# Altium schematic sheet [06] - CPU - ETHERNET, SATA.SchDoc
size A2; DocumentNumber: 6; SheetNumber: 6; SheetTotal: 32
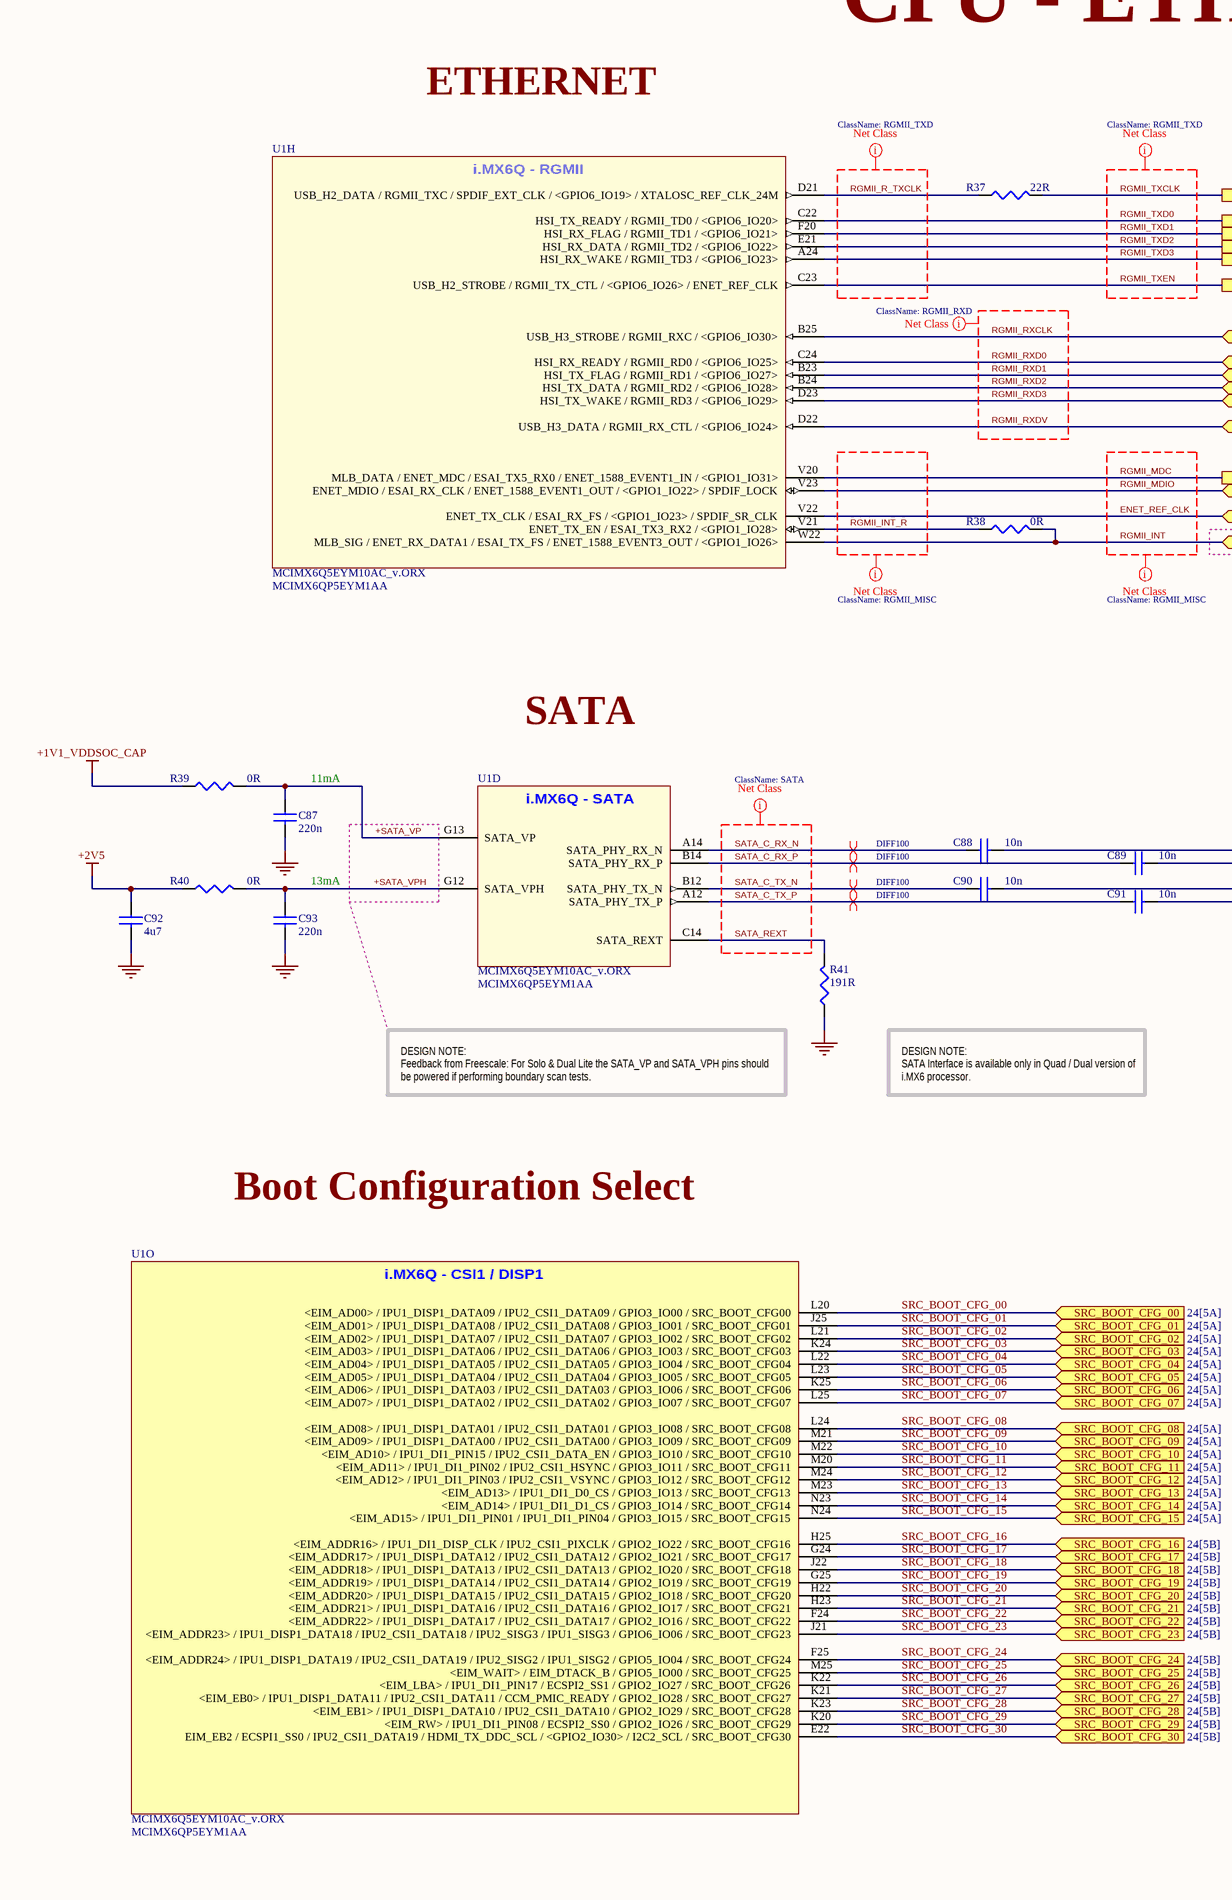
[diagram p0: [06] - CPU - ETHERNET, SATA.SchDoc, left]
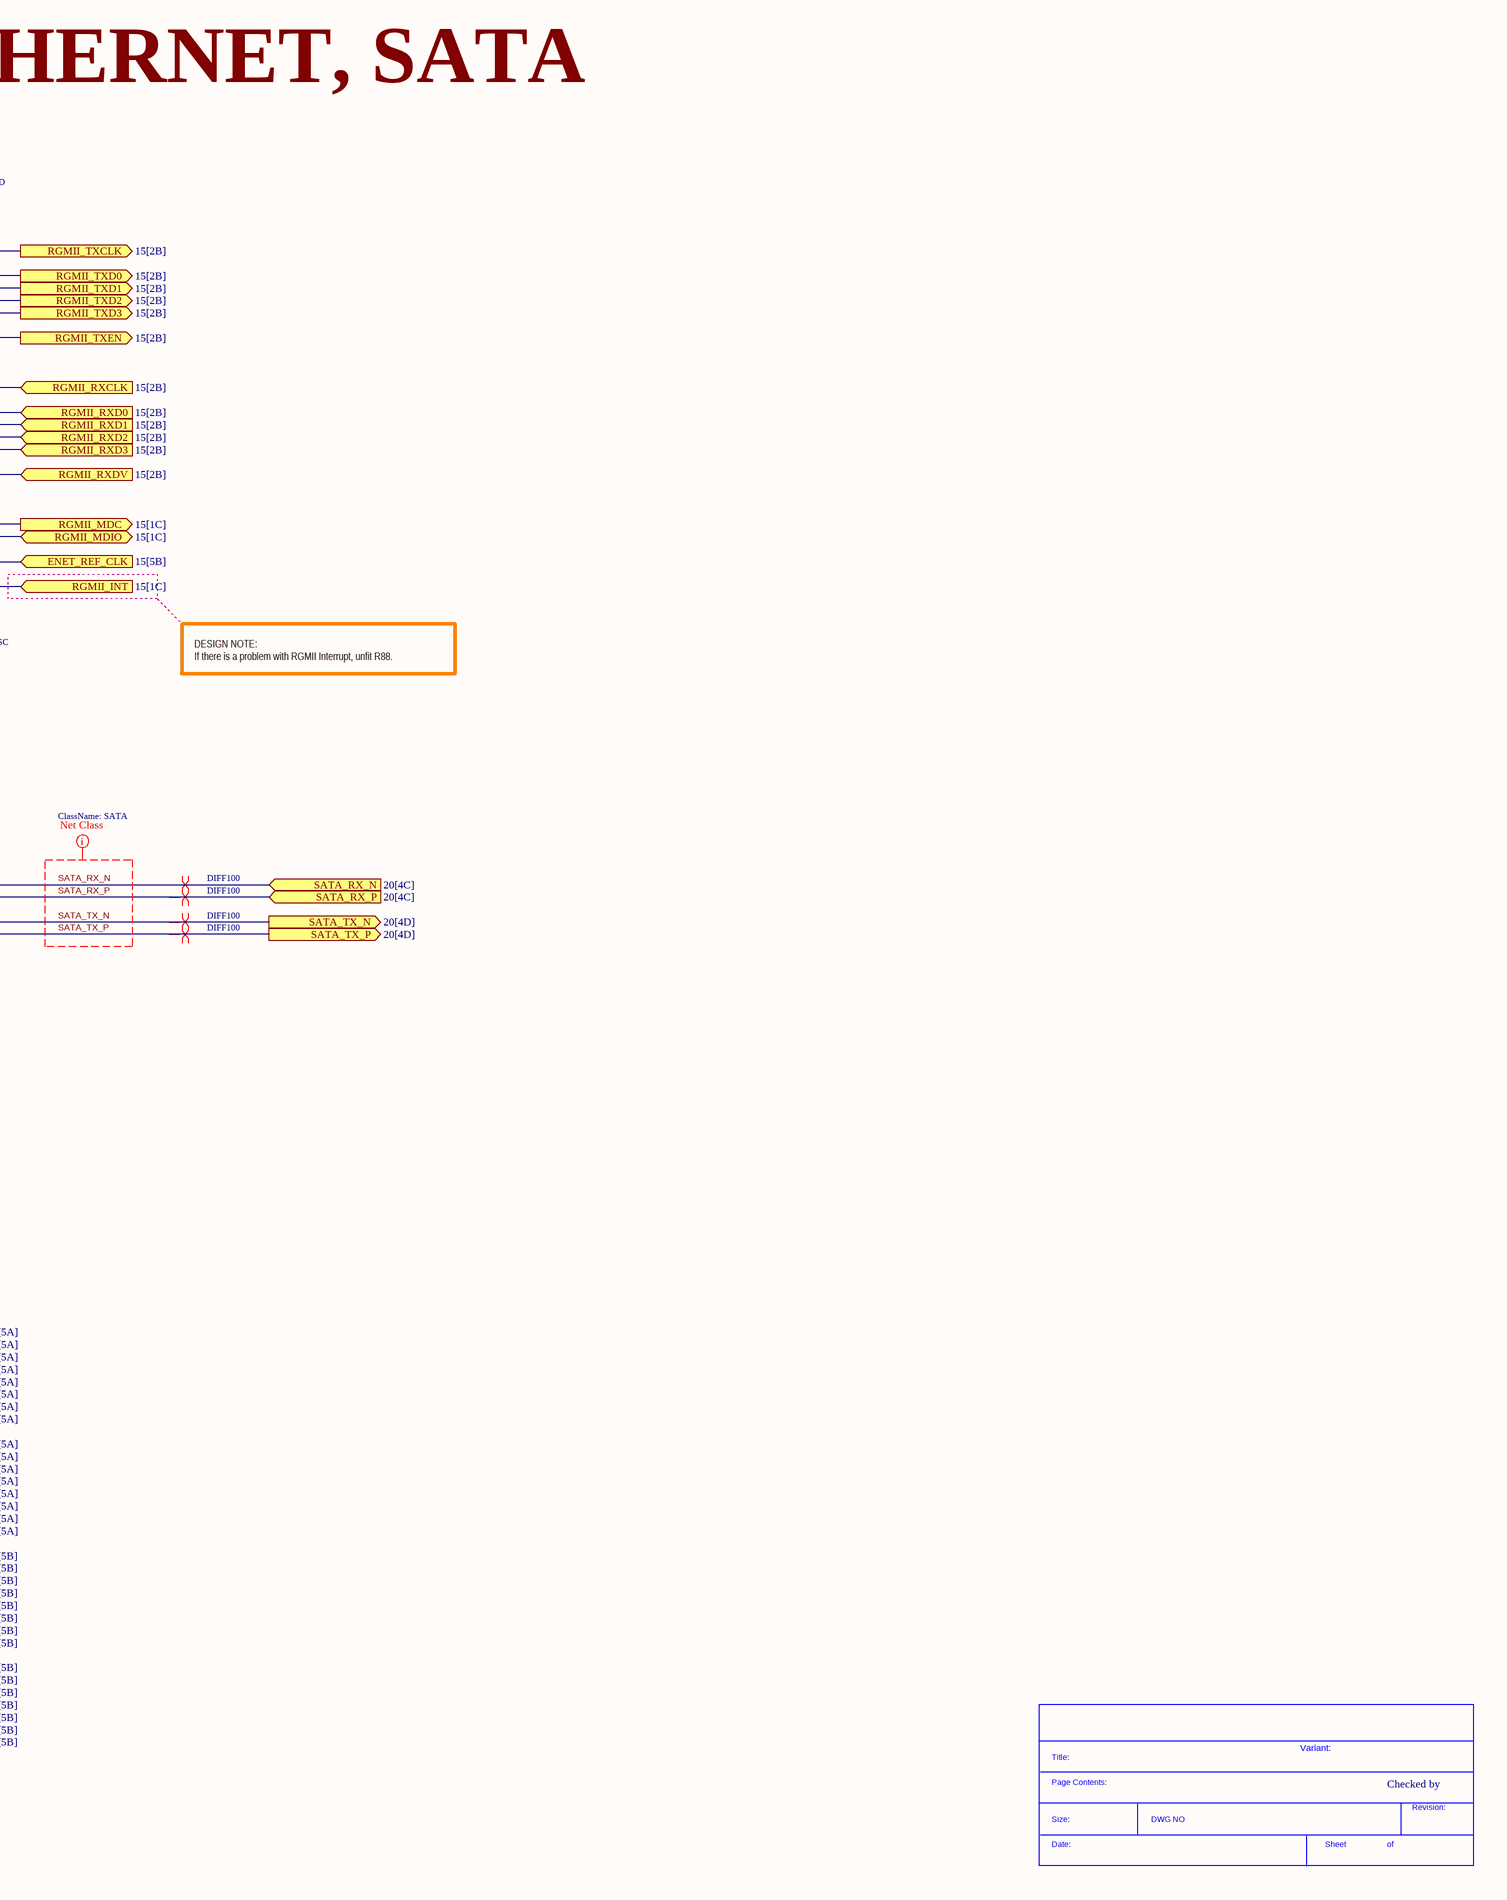
[diagram p1: [06] - CPU - ETHERNET, SATA.SchDoc, right]

## Parts
*  SDTitleBlock  (value not drawn)  (graphical)
C87  220n  [C0201]
C88  10n  [C0402]
C89  10n  [C0402]
C90  10n  [C0402]
C91  10n  [C0402]
C92  4u7  [C0402]
C93  220n  [C0201]
R37  22R  [R0402]
R38  0R  [R0402]
R39  0R  [R0402]
R40  0R  [R0402]
R41  191R  [R0201]
U1  MCIMX6Q5EYM10AC_v.ORX  Supplier Part Number 2: MCIMX6QP5EYM1AA  [PBGA624]  (parts D,H,O of 23)

## Ports
ENET_REF_CLK (in, see 15[5B]), RGMII_INT (in, see 15[1C]), RGMII_MDC (out, see 15[1C]), RGMII_MDIO (bidir, see 15[1C]), RGMII_RXCLK (in, see 15[2B]), RGMII_RXD0 (in, see 15[2B]), RGMII_RXD1 (in, see 15[2B]), RGMII_RXD2 (in, see 15[2B]), RGMII_RXD3 (in, see 15[2B]), RGMII_RXDV (in, see 15[2B]), RGMII_TXCLK (out, see 15[2B]), RGMII_TXD0 (out, see 15[2B]), RGMII_TXD1 (out, see 15[2B]), RGMII_TXD2 (out, see 15[2B]), RGMII_TXD3 (out, see 15[2B]), RGMII_TXEN (out, see 15[2B]), SATA_RX_N (in, see 20[4C]), SATA_RX_P (in, see 20[4C]), SATA_TX_N (out, see 20[4D]), SATA_TX_P (out, see 20[4D]), SRC_BOOT_CFG_00 (in, see 24[5A]), SRC_BOOT_CFG_01 (in, see 24[5A]), SRC_BOOT_CFG_02 (in, see 24[5A]), SRC_BOOT_CFG_03 (in, see 24[5A]), SRC_BOOT_CFG_04 (in, see 24[5A]), SRC_BOOT_CFG_05 (in, see 24[5A]), SRC_BOOT_CFG_06 (in, see 24[5A]), SRC_BOOT_CFG_07 (in, see 24[5A]), SRC_BOOT_CFG_08 (in, see 24[5A]), SRC_BOOT_CFG_09 (in, see 24[5A]), SRC_BOOT_CFG_10 (in, see 24[5A]), SRC_BOOT_CFG_11 (in, see 24[5A]), SRC_BOOT_CFG_12 (in, see 24[5A]), SRC_BOOT_CFG_13 (in, see 24[5A]), SRC_BOOT_CFG_14 (in, see 24[5A]), SRC_BOOT_CFG_15 (in, see 24[5A]), SRC_BOOT_CFG_16 (in, see 24[5B]), SRC_BOOT_CFG_17 (in, see 24[5B]), SRC_BOOT_CFG_18 (in, see 24[5B]), SRC_BOOT_CFG_19 (in, see 24[5B]), SRC_BOOT_CFG_20 (in, see 24[5B]), SRC_BOOT_CFG_21 (in, see 24[5B]), SRC_BOOT_CFG_22 (in, see 24[5B]), SRC_BOOT_CFG_23 (in, see 24[5B]), SRC_BOOT_CFG_24 (in, see 24[5B]), SRC_BOOT_CFG_25 (in, see 24[5B]), SRC_BOOT_CFG_26 (in, see 24[5B]), SRC_BOOT_CFG_27 (in, see 24[5B]), SRC_BOOT_CFG_28 (in, see 24[5B]), SRC_BOOT_CFG_29 (in, see 24[5B]), SRC_BOOT_CFG_30 (in, see 24[5B])

## Nets
+1V1_VDDSOC_CAP: R39.1
+2V5: C92.1 R40.1
GND: C87.2 C92.2 C93.2 R41.1
+SATA_VP: C87.1 R39.2 U1.G13(SATA_VP)
+SATA_VPH: C93.1 R40.2 U1.G12(SATA_VPH)
ENET_REF_CLK: U1.V22(ENET_TX_CLK_/_ESAI_RX_FS_/_<GPIO1_IO23>_/_SPDIF_SR_CLK) ; port ENET_REF_CLK
RGMII_INT: R38.2 U1.W22(MLB_SIG_/_ENET_RX_DATA1_/_ESAI_TX_FS_/_ENET_1588_EVENT3_OUT_/_<GPIO1_IO26>) ; port RGMII_INT
RGMII_INT_R: R38.1 U1.V21(ENET_TX_EN_/_ESAI_TX3_RX2_/_<GPIO1_IO28>)
RGMII_MDC: U1.V20(MLB_DATA_/_ENET_MDC_/_ESAI_TX5_RX0_/_ENET_1588_EVENT1_IN_/_<GPIO1_IO31>) ; port RGMII_MDC
RGMII_MDIO: U1.V23(ENET_MDIO_/_ESAI_RX_CLK_/_ENET_1588_EVENT1_OUT_/_<GPIO1_IO22>_/_SPDIF_LOCK) ; port RGMII_MDIO
RGMII_R_TXCLK: R37.1 U1.D21(USB_H2_DATA_/_RGMII_TXC_/_SPDIF_EXT_CLK_/_<GPIO6_IO19>_/_XTALOSC_REF_CLK_24M)
RGMII_RXCLK: U1.B25(USB_H3_STROBE_/_RGMII_RXC_/_<GPIO6_IO30>) ; port RGMII_RXCLK
RGMII_RXD0: U1.C24(HSI_RX_READY_/_RGMII_RD0_/_<GPIO6_IO25>) ; port RGMII_RXD0
RGMII_RXD1: U1.B23(HSI_TX_FLAG_/_RGMII_RD1_/_<GPIO6_IO27>) ; port RGMII_RXD1
RGMII_RXD2: U1.B24(HSI_TX_DATA_/_RGMII_RD2_/_<GPIO6_IO28>) ; port RGMII_RXD2
RGMII_RXD3: U1.D23(HSI_TX_WAKE_/_RGMII_RD3_/_<GPIO6_IO29>) ; port RGMII_RXD3
RGMII_RXDV: U1.D22(USB_H3_DATA_/_RGMII_RX_CTL_/_<GPIO6_IO24>) ; port RGMII_RXDV
RGMII_TXCLK: R37.2 ; port RGMII_TXCLK
RGMII_TXD0: U1.C22(HSI_TX_READY_/_RGMII_TD0_/_<GPIO6_IO20>) ; port RGMII_TXD0
RGMII_TXD1: U1.F20(HSI_RX_FLAG_/_RGMII_TD1_/_<GPIO6_IO21>) ; port RGMII_TXD1
RGMII_TXD2: U1.E21(HSI_RX_DATA_/_RGMII_TD2_/_<GPIO6_IO22>) ; port RGMII_TXD2
RGMII_TXD3: U1.A24(HSI_RX_WAKE_/_RGMII_TD3_/_<GPIO6_IO23>) ; port RGMII_TXD3
RGMII_TXEN: U1.C23(USB_H2_STROBE_/_RGMII_TX_CTL_/_<GPIO6_IO26>_/_ENET_REF_CLK) ; port RGMII_TXEN
SATA_C_RX_N: C88.1 U1.A14(SATA_PHY_RX_N)
SATA_C_RX_P: C89.1 U1.B14(SATA_PHY_RX_P)
SATA_C_TX_N: C90.1 U1.B12(SATA_PHY_TX_N)
SATA_C_TX_P: C91.1 U1.A12(SATA_PHY_TX_P)
SATA_REXT: R41.2 U1.C14(SATA_REXT)
SATA_RX_N: C88.2 ; port SATA_RX_N
SATA_RX_P: C89.2 ; port SATA_RX_P
SATA_TX_N: C90.2 ; port SATA_TX_N
SATA_TX_P: C91.2 ; port SATA_TX_P
SRC_BOOT_CFG_00: U1.L20(<EIM_AD00>_/_IPU1_DISP1_DATA09_/_IPU2_CSI1_DATA09_/_GPIO3_IO00_/_SRC_BOOT_CFG00) ; port SRC_BOOT_CFG_00
SRC_BOOT_CFG_01: U1.J25(<EIM_AD01>_/_IPU1_DISP1_DATA08_/_IPU2_CSI1_DATA08_/_GPIO3_IO01_/_SRC_BOOT_CFG01) ; port SRC_BOOT_CFG_01
SRC_BOOT_CFG_02: U1.L21(<EIM_AD02>_/_IPU1_DISP1_DATA07_/_IPU2_CSI1_DATA07_/_GPIO3_IO02_/_SRC_BOOT_CFG02) ; port SRC_BOOT_CFG_02
SRC_BOOT_CFG_03: U1.K24(<EIM_AD03>_/_IPU1_DISP1_DATA06_/_IPU2_CSI1_DATA06_/_GPIO3_IO03_/_SRC_BOOT_CFG03) ; port SRC_BOOT_CFG_03
SRC_BOOT_CFG_04: U1.L22(<EIM_AD04>_/_IPU1_DISP1_DATA05_/_IPU2_CSI1_DATA05_/_GPIO3_IO04_/_SRC_BOOT_CFG04) ; port SRC_BOOT_CFG_04
SRC_BOOT_CFG_05: U1.L23(<EIM_AD05>_/_IPU1_DISP1_DATA04_/_IPU2_CSI1_DATA04_/_GPIO3_IO05_/_SRC_BOOT_CFG05) ; port SRC_BOOT_CFG_05
SRC_BOOT_CFG_06: U1.K25(<EIM_AD06>_/_IPU1_DISP1_DATA03_/_IPU2_CSI1_DATA03_/_GPIO3_IO06_/_SRC_BOOT_CFG06) ; port SRC_BOOT_CFG_06
SRC_BOOT_CFG_07: U1.L25(<EIM_AD07>_/_IPU1_DISP1_DATA02_/_IPU2_CSI1_DATA02_/_GPIO3_IO07_/_SRC_BOOT_CFG07) ; port SRC_BOOT_CFG_07
SRC_BOOT_CFG_08: U1.L24(<EIM_AD08>_/_IPU1_DISP1_DATA01_/_IPU2_CSI1_DATA01_/_GPIO3_IO08_/_SRC_BOOT_CFG08) ; port SRC_BOOT_CFG_08
SRC_BOOT_CFG_09: U1.M21(<EIM_AD09>_/_IPU1_DISP1_DATA00_/_IPU2_CSI1_DATA00_/_GPIO3_IO09_/_SRC_BOOT_CFG09) ; port SRC_BOOT_CFG_09
SRC_BOOT_CFG_10: U1.M22(<EIM_AD10>_/_IPU1_DI1_PIN15_/_IPU2_CSI1_DATA_EN_/_GPIO3_IO10_/_SRC_BOOT_CFG10) ; port SRC_BOOT_CFG_10
SRC_BOOT_CFG_11: U1.M20(<EIM_AD11>_/_IPU1_DI1_PIN02_/_IPU2_CSI1_HSYNC_/_GPIO3_IO11_/_SRC_BOOT_CFG11) ; port SRC_BOOT_CFG_11
SRC_BOOT_CFG_12: U1.M24(<EIM_AD12>_/_IPU1_DI1_PIN03_/_IPU2_CSI1_VSYNC_/_GPIO3_IO12_/_SRC_BOOT_CFG12) ; port SRC_BOOT_CFG_12
SRC_BOOT_CFG_13: U1.M23(<EIM_AD13>_/_IPU1_DI1_D0_CS_/_GPIO3_IO13_/_SRC_BOOT_CFG13) ; port SRC_BOOT_CFG_13
SRC_BOOT_CFG_14: U1.N23(<EIM_AD14>_/_IPU1_DI1_D1_CS_/_GPIO3_IO14_/_SRC_BOOT_CFG14) ; port SRC_BOOT_CFG_14
SRC_BOOT_CFG_15: U1.N24(<EIM_AD15>_/_IPU1_DI1_PIN01_/_IPU1_DI1_PIN04_/_GPIO3_IO15_/_SRC_BOOT_CFG15) ; port SRC_BOOT_CFG_15
SRC_BOOT_CFG_16: U1.H25(<EIM_ADDR16>_/_IPU1_DI1_DISP_CLK_/_IPU2_CSI1_PIXCLK_/_GPIO2_IO22_/_SRC_BOOT_CFG16) ; port SRC_BOOT_CFG_16
SRC_BOOT_CFG_17: U1.G24(<EIM_ADDR17>_/_IPU1_DISP1_DATA12_/_IPU2_CSI1_DATA12_/_GPIO2_IO21_/_SRC_BOOT_CFG17) ; port SRC_BOOT_CFG_17
SRC_BOOT_CFG_18: U1.J22(<EIM_ADDR18>_/_IPU1_DISP1_DATA13_/_IPU2_CSI1_DATA13_/_GPIO2_IO20_/_SRC_BOOT_CFG18) ; port SRC_BOOT_CFG_18
SRC_BOOT_CFG_19: U1.G25(<EIM_ADDR19>_/_IPU1_DISP1_DATA14_/_IPU2_CSI1_DATA14_/_GPIO2_IO19_/_SRC_BOOT_CFG19) ; port SRC_BOOT_CFG_19
SRC_BOOT_CFG_20: U1.H22(<EIM_ADDR20>_/_IPU1_DISP1_DATA15_/_IPU2_CSI1_DATA15_/_GPIO2_IO18_/_SRC_BOOT_CFG20) ; port SRC_BOOT_CFG_20
SRC_BOOT_CFG_21: U1.H23(<EIM_ADDR21>_/_IPU1_DISP1_DATA16_/_IPU2_CSI1_DATA16_/_GPIO2_IO17_/_SRC_BOOT_CFG21) ; port SRC_BOOT_CFG_21
SRC_BOOT_CFG_22: U1.F24(<EIM_ADDR22>_/_IPU1_DISP1_DATA17_/_IPU2_CSI1_DATA17_/_GPIO2_IO16_/_SRC_BOOT_CFG22) ; port SRC_BOOT_CFG_22
SRC_BOOT_CFG_23: U1.J21(<EIM_ADDR23>_/_IPU1_DISP1_DATA18_/_IPU2_CSI1_DATA18_/_IPU2_SISG3_/_IPU1_SISG3_/_GPIO6_IO06_/_SRC_BOOT_CFG23) ; port SRC_BOOT_CFG_23
SRC_BOOT_CFG_24: U1.F25(<EIM_ADDR24>_/_IPU1_DISP1_DATA19_/_IPU2_CSI1_DATA19_/_IPU2_SISG2_/_IPU1_SISG2_/_GPIO5_IO04_/_SRC_BOOT_CFG24) ; port SRC_BOOT_CFG_24
SRC_BOOT_CFG_25: U1.M25(<EIM_WAIT>_/_EIM_DTACK_B_/_GPIO5_IO00_/_SRC_BOOT_CFG25) ; port SRC_BOOT_CFG_25
SRC_BOOT_CFG_26: U1.K22(<EIM_LBA>_/_IPU1_DI1_PIN17_/_ECSPI2_SS1_/_GPIO2_IO27_/_SRC_BOOT_CFG26) ; port SRC_BOOT_CFG_26
SRC_BOOT_CFG_27: U1.K21(<EIM_EB0>_/_IPU1_DISP1_DATA11_/_IPU2_CSI1_DATA11_/_CCM_PMIC_READY_/_GPIO2_IO28_/_SRC_BOOT_CFG27) ; port SRC_BOOT_CFG_27
SRC_BOOT_CFG_28: U1.K23(<EIM_EB1>_/_IPU1_DISP1_DATA10_/_IPU2_CSI1_DATA10_/_GPIO2_IO29_/_SRC_BOOT_CFG28) ; port SRC_BOOT_CFG_28
SRC_BOOT_CFG_29: U1.K20(<EIM_RW>_/_IPU1_DI1_PIN08_/_ECSPI2_SS0_/_GPIO2_IO26_/_SRC_BOOT_CFG29) ; port SRC_BOOT_CFG_29
SRC_BOOT_CFG_30: U1.E22(EIM_EB2_/_ECSPI1_SS0_/_IPU2_CSI1_DATA19_/_HDMI_TX_DDC_SCL_/_<GPIO2_IO30>_/_I2C2_SCL_/_SRC_BOOT_CFG30) ; port SRC_BOOT_CFG_30

## Layout directives
net class RGMII_MISC: ENET_REF_CLK, RGMII_INT, RGMII_INT_R, RGMII_MDC, RGMII_MDIO
net class RGMII_TXD: RGMII_R_TXCLK, RGMII_TXCLK, RGMII_TXD0, RGMII_TXD1, RGMII_TXD2, RGMII_TXD3, RGMII_TXEN
net class RGMII_RXD: RGMII_RXCLK, RGMII_RXD0, RGMII_RXD1, RGMII_RXD2, RGMII_RXD3, RGMII_RXDV
differential pair; net class DIFF100: SATA_C_RX_N, SATA_C_RX_P, SATA_C_TX_N, SATA_C_TX_P, SATA_RX_N, SATA_RX_P, SATA_TX_N, SATA_TX_P
net class SATA: SATA_C_RX_N, SATA_C_RX_P, SATA_C_TX_N, SATA_C_TX_P, SATA_REXT, SATA_RX_N, SATA_RX_P, SATA_TX_N, SATA_TX_P
net class [06] - ETTHERNET/SATA: (no net found under the mark)

## Notes on the sheet
- CPU - ETHERNET, SATA
- ETHERNET
- DESIGN NOTE:
  If there is a problem with RGMII Interrupt, unfit R88.
- SATA
- (near C87) 11mA
- 13mA
- DESIGN NOTE:
  Feedback from Freescale: For Solo & Dual Lite the SATA_VP and SATA_VPH pins should be powered if performing boundary scan tests.
- DESIGN NOTE:
  SATA Interface is available only in Quad / Dual version of i.MX6 processor.
- Boot Configuration Select
- Variant:
- Checked by
- (in symbol MCIMX6Q5EYM10AC_v.ORX, part D) i.MX6Q - SATA
- (in symbol MCIMX6Q5EYM10AC_v.ORX, part H) i.MX6Q - RGMII
- (in symbol MCIMX6Q5EYM10AC_v.ORX, part O) i.MX6Q - CSI1 / DISP1
- (in symbol SDTitleBlock) Title:; Page Contents:; Revision:; Size:; DWG NO; Date:; Sheet; of

## Library data of the parts
C87 C93 = C0603X5R0J224M030BB: CAP CER 0.22UF 6.3V 20% X5R 0201; Manufacturer: TDK Corporation; Capacitance: 0.22µF; .Checked PCB: used; .Creator: MM; Supplier 1: Digi-Key; Manufacturer Part Number: C0603X5R0J224M030BB; RoHS: RoHS Compliant; Category: Capacitors; Stock 1: 205900; Pricing 1: 1=0.15, 10=0.102, 100=0.0485, 250=0.0408, 500=0.03418, 1000=0.0275, 5000=0.02325 (USD); Packaging: Cut Tape (CT); Tolerance: ±20%; Voltage - Rated: 6.3V; Temperature Coefficient: X5R; Mounting Type: Surface Mount, MLCC; Operating Temperature: -55°C ~ 85°C; Applications: General Purpose; Ratings: -; Package / Case: 0201 (0603 Metric); Size / Dimension: 0.024" L x 0.012" W (0.60mm x 0.30mm); Height - Seated (Max): -; Thickness (Max): 0.013" (0.33mm); Lead Spacing: -; Features: -; Lead Style: -; ComponentLink1URL: http://product.tdk.com/en/catalog/datasheets/mlcc_commercial_general_en.pdf; ComponentLink1Description: http://product.tdk.com/en/catalog/datasheets/mlcc_commercial_general_en.pdf; Supplier Part Number 1: 445-5929-1-ND; .Checked SCH: used; Supplier 2: Digi-Key; Supplier Part Number 2: 1276-1042-6-ND
C88-C91 = C1005X7R1H103K: CAP CER 10000PF 50V 10% X7R 0402; Manufacturer: TDK Corporation; Value: 10nF; .Checked PCB: used; Capacitance: 10000pF; Category: Capacitors; Supplier Part Number: 445-6850-1-ND; Manufacturer Part Number: C1005X7R1H103K; Operating Temperature: -55°C ~ 125°C; Package / Case: 0402 (1005 Metric); Price 1k [$]: 0.01625; .Checked SCH: used; Voltage - Rated: 50V; Supplier: Digikey; Supplier 1: Digi-Key; Supplier Part Number 1: 445-6850-1-ND; RoHS: RoHS Compliant; Stock 1: 3901; Pricing 1: 1=0.2, 10=0.125, 100=0.045, 250=0.03252, 500=0.024, 1000=0.01625 (USD); Tolerance: ±10%; Temperature Coefficient: X7R; Mounting Type: Surface Mount, MLCC; Applications: General Purpose; Ratings: -; Size / Dimension: 0.039" L x 0.020" W (1.00mm x 0.50mm); Height - Seated (Max): -; Thickness (Max): 0.022" (0.55mm); Lead Spacing: -; Features: -; Packaging: Cut Tape (CT); Lead Style: -; ComponentLink1URL: http://www.tdk.co.jp/tefe02/e412_c.pdf; ComponentLink1Description: http://www.tdk.co.jp/tefe02/e412_c.pdf; Supplier 2: Digi-Key; Supplier Part Number 2: 490-4516-6-ND
C92 = C1005X5R1A475M: CAP CER 4.7UF 10V 20% X5R 0402; Manufacturer: TDK Corporation; Capacitance: 4.7µF; .Checked PCB: used; Supplier 1: Digi-Key; Supplier Part Number 1: 445-8023-1-ND; Manufacturer Part Number: C1005X5R1A475M; RoHS: RoHS Compliant; Category: Capacitors; Stock 1: 10140; Pricing 1: 1=0.53, 10=0.415, 100=0.25, 250=0.18752, 500=0.16, 1000=0.125, 5000=0.095 (USD); Voltage - Rated: 10V; Tolerance: ±20%; Temperature Coefficient: X5R; Mounting Type: Surface Mount, MLCC; Operating Temperature: -55°C ~ 85°C; Applications: General Purpose; Ratings: -; Package / Case: 0402 (1005 Metric); Size / Dimension: 0.039" L x 0.020" W (1.00mm x 0.50mm); Height - Seated (Max): -; Thickness (Max): -; Lead Spacing: -; Features: -; Packaging: Cut Tape (CT); Lead Style: -; ComponentLink1URL: http://www.tdk.com/pdf/general_B11.pdf; ComponentLink1Description: http://www.tdk.com/pdf/general_B11.pdf; .Checked SCH: used
R37 = RC0402FR-0722RL: RES 22.0 OHM 1/16W 1% 0402 SMD; Manufacturer: Yageo; Resistance (Ohms): 22; Power (Watts): 0.063W, 1/16W; .Checked PCB: used; Temperature Coefficient: ±100ppm/°C; Category: Resistors; Supplier Part Number: 311-22.0LRCT-ND; Manufacturer Part Number: RC0402FR-0722RL; Package / Case: 0402 (1005 Metric); Price 1k [$]: 0.01421; Tolerance: ±1%; Value: 22R; .Checked SCH: used; Supplier: Digikey; Supplier 1: Digi-Key; Supplier Part Number 1: 311-22.0LRCT-ND; RoHS: RoHS Compliant; Stock 1: 943800; Pricing 1: 10=0.014, 50=0.0104, 100=0.0079, 250=0.00584, 500=0.00432, 1000=0.00288 (USD); Composition: Thick Film; Features: -; Size / Dimension: 0.039" L x 0.020" W (1.00mm x 0.50mm); Height: 0.016" (0.40mm); Number of Terminations: 2; Packaging: Cut Tape (CT); ComponentLink1URL: http://www.yageo.com/documents/recent/PYu-RC0402_51_RoHS_L_6.pdf; ComponentLink1Description: http://www.yageo.com/documents/recent/PYu-RC0402_51_RoHS_L_6.pdf
R38-R40 = RC0402JR-070RL: RES 0.0 OHM 1/16W 0402 SMD; Manufacturer: Yageo; Resistance (Ohms): 0.0; Power (Watts): 0.063W, 1/16W; Tolerance: Jumper; .Checked PCB: used; Category: Resistors; Supplier Part Number: 311-0.0JRCT-ND; Manufacturer Part Number: RC0402JR-070RL; Package / Case: 0402 (1005 Metric); Price 1k [$]: 0.01389; Value: 0R; .Checked SCH: used; Supplier: Digikey; Supplier 1: Digi-Key; Supplier Part Number 1: 311-0.0JRCT-ND; RoHS: RoHS Compliant; Stock 1: 1106330; Pricing 1: 10=0.012, 50=0.009, 100=0.0069, 250=0.00512, 500=0.0038, 1000=0.00253 (USD); Composition: Thick Film; Features: -; Temperature Coefficient: -; Size / Dimension: 0.039" L x 0.020" W (1.00mm x 0.50mm); Height: 0.016" (0.40mm); Number of Terminations: 2; Packaging: Cut Tape (CT); ComponentLink1URL: http://www.yageo.com/documents/recent/PYu-RC0402_51_RoHS_L_6.pdf; ComponentLink1Description: http://www.yageo.com/documents/recent/PYu-RC0402_51_RoHS_L_6.pdf
R41 = ERJ-1GEF1910C: RES 191 OHM 1/20W 1% 0201 SMD; Manufacturer: Panasonic Electronic Components; Resistance (Ohms): 191; Power (Watts): 0.05W, 1/20W; Temperature Coefficient: ±200ppm/°C; .Creator: MM; .Checked PCB: used; Supplier 1: Digi-Key; Manufacturer Part Number: ERJ-1GEF1910C; RoHS: RoHS Compliant; Category: Resistors; Stock 1: 34157; Pricing 1: 1=0.11, 50=0.0414, 100=0.0315, 250=0.0234, 500=0.01728, 1000=0.01152, 5000=0.0081 (USD); Packaging: Cut Tape (CT); Tolerance: ±1%; Composition: Thick Film; Features: -; Package / Case: 0201 (0603 Metric); Supplier Device Package: 0201; Size / Dimension: 0.024" L x 0.012" W (0.60mm x 0.30mm); Height: 0.010" (0.26mm); Number of Terminations: 2; ComponentLink1URL: http://media.digikey.com/pdf/Data%20Sheets/Panasonic%20Resistors%20Thermistors%20PDFs/ERJ_G,R,E_Rev08.pdf; ComponentLink1Description: http://media.digikey.com/pdf/Data%20Sheets/Panasonic%20Resistors%20Thermistors%20PDFs/ERJ_G,R,E_Rev08.pdf; Supplier Part Number 1: P191ABCT-ND; .Checked SCH: used
U1 = MCIMX6Q5EYM10AC_v.ORX: IC MCU 32BIT ARM QUAD 624FCBGA; Manufacturer: Freescale Semiconductor; Speed: 1.0GHz; .Creator: MM; .Checked PCB: used; Core Processor: ARM® Cortex™-A9; Core Size: 32-Bit Quad-Core; Connectivity: CAN, EBI/EMI, ESAI, Ethernet, GPMI, I2C, MMC/SD, PCI, SATA, SPI, UART, USB, USB OTG; Peripherals: DMA, HDMI, I2S/SSI/AC97, MIPI CSI, MIMI DSI, MIPI HIS, PWM, WDT; Number of I /O: 224; Program Memory Type: External Program Memory; RAM Size: 256K x 8; Voltage - Supply (Vcc/Vdd): 0.925 V ~ 1.5 V; Oscillator Type: Internal; Supplier 1: Digi-Key; Manufacturer Part Number: MCIMX6Q5EYM10AC; RoHS: RoHS Compliant; Category: Integrated Circuits (ICs); Stock 1: 0; Pricing 1: 1=54.98, 10=51.922, 25=48.868, 100=30.5424 (USD); Packaging: Tray; Package / Case: 624-FBGA, FCBGA; ComponentLink1URL: http://cache.freescale.com/files/32bit/doc/data_sheet/IMX6DQCEC.pdf; ComponentLink1Description: Data Sheet; Supplier Part Number 1: MCIMX6Q5EYM10AC-ND; .Checked SCH: used; Program Memory Size: -; EEPROM Size: -; Data Converters: -; Operating Temperature: -20°C ~ 105°C; ComponentLink2Description: User Guide; ComponentLink2URL: file:///C:/Users/mbeach/Downloads/i.MX_Linux_User's_Guide.pdf; Supplier 2: Arrow